# EAGLE design ring-modulator-v1.1 (EAGLE 6.5.0)
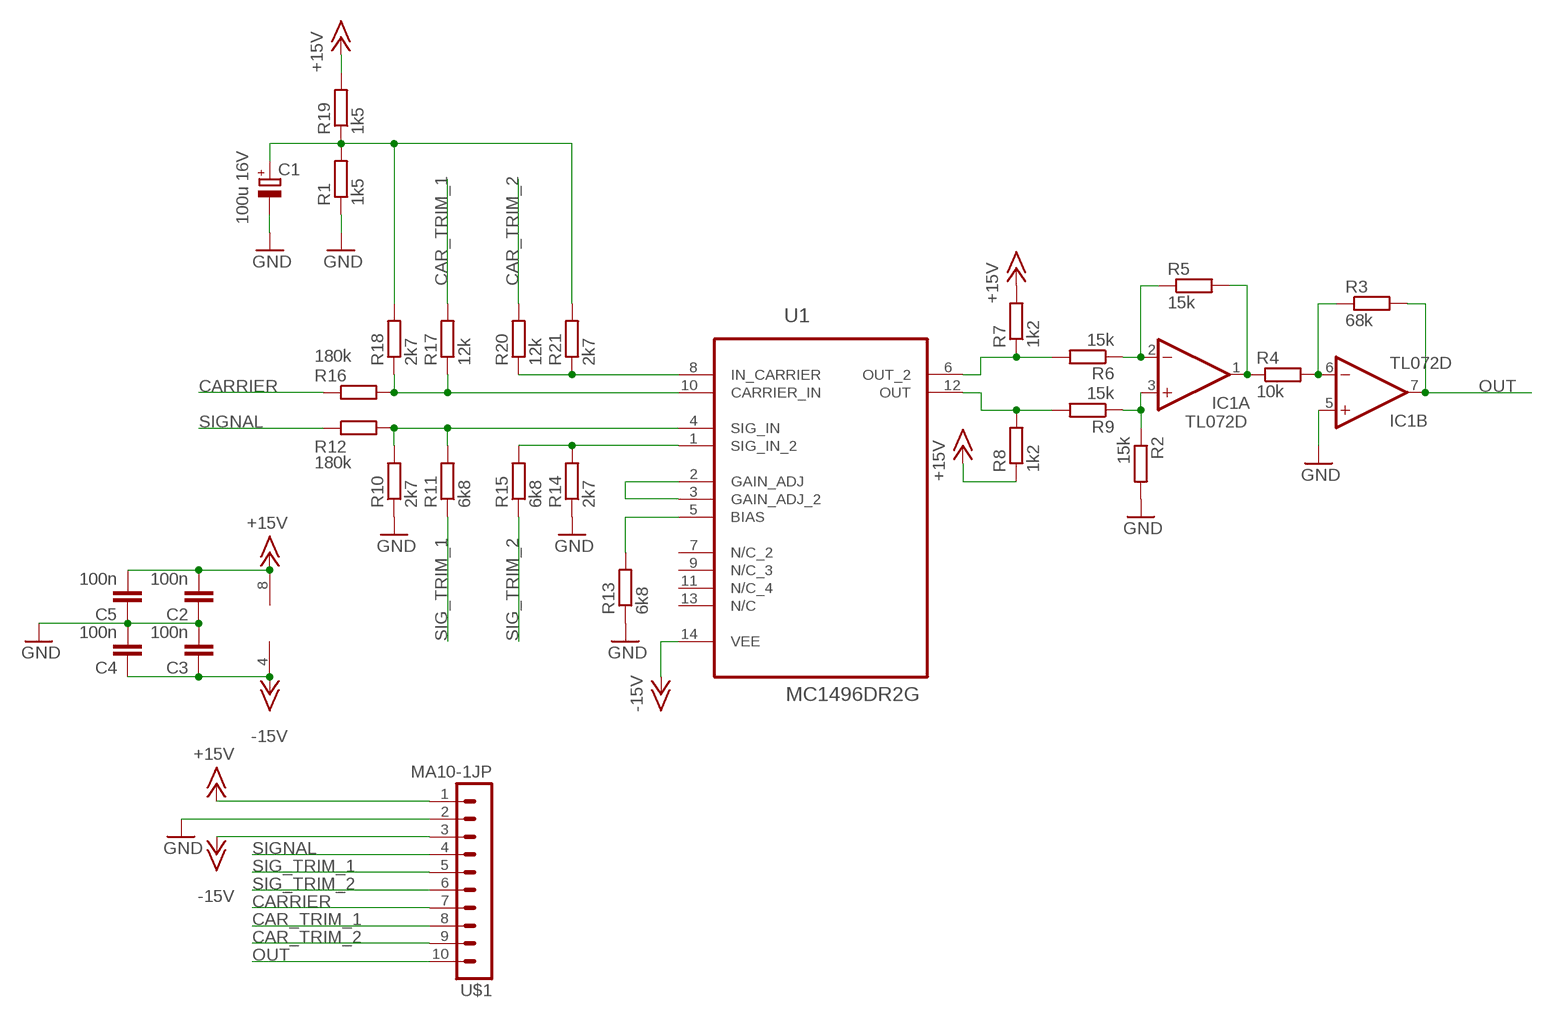
[diagram p0: schematic, sheet 1]

## Parts
C1  100u 16V  CPOL-EUE2.5-5  [E2,5-5]
C2  100n  C-EUC0805  [C0805]
C3  100n  C-EUC0805  [C0805]
C4  100n  C-EUC0805  [C0805]
C5  100n  C-EUC0805  [C0805]
IC1  TL072D  [SO08J]
R1  1k5  R-EU_R0805  [R0805]
R2  15k  R-EU_R0805  [R0805]
R3  68k  R-EU_R0805  [R0805]
R4  10k  R-EU_R0805  [R0805]
R5  15k  R-EU_R0805  [R0805]
R6  15k  R-EU_R0805  [R0805]
R7  1k2  R-EU_R0805  [R0805]
R8  1k2  R-EU_R0805  [R0805]
R9  15k  R-EU_R0805  [R0805]
R10  2k7  R-EU_R0805  [R0805]
R11  6k8  R-EU_R0805  [R0805]
R12  180k  R-EU_R0805  [R0805]
R13  6k8  R-EU_R0805  [R0805]
R14  2k7  R-EU_R0805  [R0805]
R15  6k8  R-EU_R0805  [R0805]
R16  180k  R-EU_R0805  [R0805]
R17  12k  R-EU_R0805  [R0805]
R18  2k7  R-EU_R0805  [R0805]
R19  1k5  R-EU_R0805  [R0805]
R20  12k  R-EU_R0805  [R0805]
R21  2k7  R-EU_R0805  [R0805]
U1  MC1496DR2G  [SOIC127P600X175-14N]
U$1  MA10-1JP  [SIP-PIN10-1J]

## Nets
+15V: C2.2 C5.2 IC1.8(P:V+) R7.2 R8.1 R19.2 U$1.1
-15V: C3.1 C4.1 IC1.4(P:V-) U1.14(VEE) U$1.3
CAR_TRIM_1: R17.2 U$1.8
CAR_TRIM_2: R20.2 U$1.9
CARRIER: R16.1 U$1.7
GND: C1.- C2.1 C3.2 C4.2 C5.1 IC1.5(B:+IN) R1.1 R2.2 R10.1 R13.1 R14.1 U$1.2
N$1: R10.2 R11.2 R12.2 U1.4(SIG_IN)
N$2: R16.2 R17.1 R18.1 U1.10(CARRIER_IN)
N$3: R14.2 R15.2 U1.1(SIG_IN_2)
N$8: R20.1 R21.1 U1.8(IN_CARRIER)
N$9: C1.+ R1.2 R18.2 R19.1 R21.2
N$11: R13.2 U1.5(BIAS)
N$12: U1.2(GAIN_ADJ) U1.3(GAIN_ADJ_2)
N$13: R6.2 R7.1 U1.6(OUT_2)
N$14: R8.2 R9.2 U1.12(OUT)
N$15: IC1.3(A:+IN) R2.1 R9.1
N$16: IC1.2(A:-IN) R5.1 R6.1
N$17: IC1.1(A:OUT) R4.1 R5.2
N$18: IC1.6(B:-IN) R3.1 R4.2
OUT: IC1.7(B:OUT) R3.2 U$1.10
SIG_TRIM_1: R11.1 U$1.5
SIG_TRIM_2: R15.1 U$1.6
SIGNAL: R12.1 U$1.4
Unconnected: U1.7(N/C_2) U1.9(N/C_3) U1.11(N/C_4) U1.13(N/C)

## Library data of the parts
C1 = resistor:CPOL-EU: POLARIZED CAPACITOR, European symbol
C2-C5 = resistor:C-EU: CAPACITOR, European symbol
IC1 = joakim:TL072: OP AMP
R1-R21 = resistor:R-EU_: RESISTOR, European symbol
U1 = ON Semiconductor_By_element14_Batch_1:MC1496DR2G: Balanced Modulators/Demodulators; MPN: MC1496DR2G; OC_FARNELL: 1651904; OC_NEWARK: 45J1148; PACKAGE: SOIC-14; SUPPLIER: ON SEMICONDUCTOR
U$1 = joakim:MA10-1J

## Board
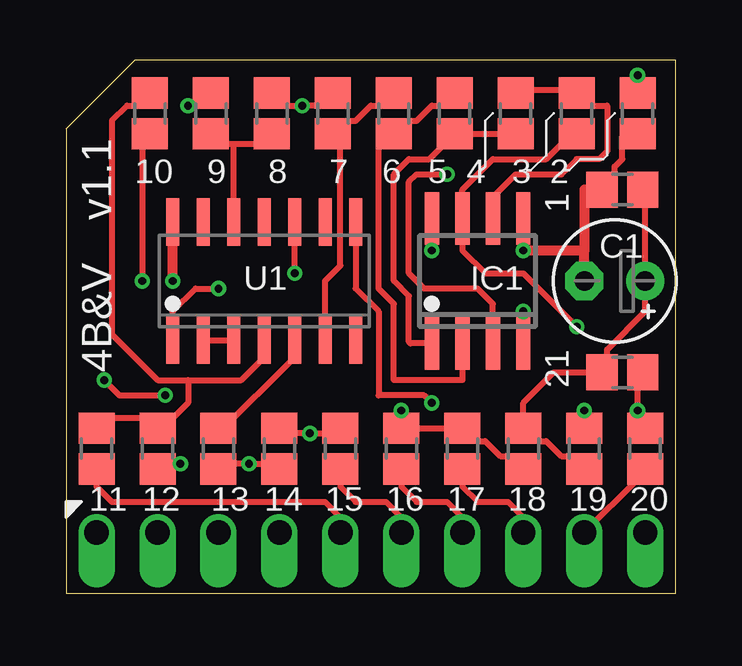
[diagram p1: board, top side]
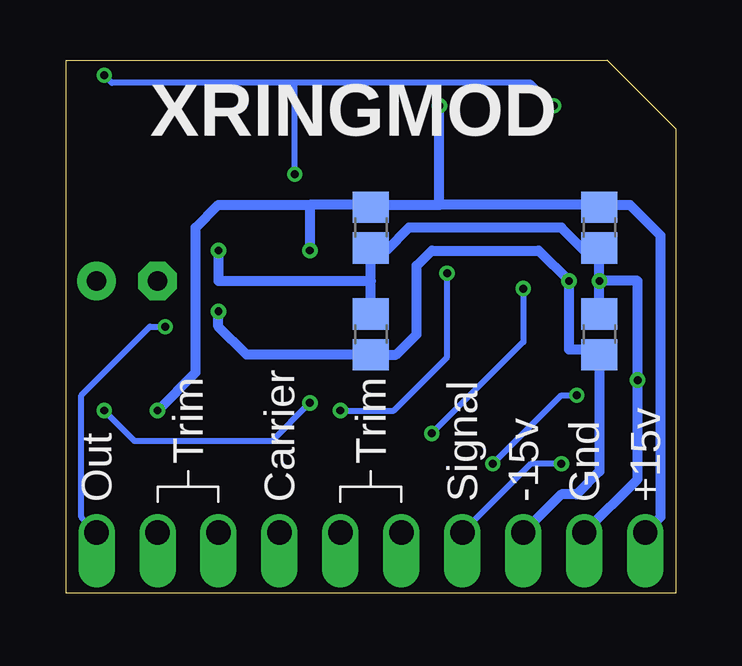
[diagram p2: board, bottom side, seen from below]

Size 25.4 x 22.23 mm. Coordinates in mm from the lower left corner, seen from the top.
Outline: 0,0 25.4,0 25.4,22.23 2.86,22.23 0,19.37 0,0
Copper layers (1*16): Top 0.035mm / dielectric 1.5mm / Bottom 0.035mm
Design rules "dirt_cheap_dirty_boards.v1": minimum track width 5mil, minimum drill 12mil, track to track 5mil, track to pad 5mil, pad to pad 5mil, via to via 5mil, smd to smd 0mil, copper to edge 10mil, drill to drill 10mil, minimum pad ring 10mil, minimum via ring 6mil, stop-mask expansion 2mil, vias tented up to drill 25mil, thermal gap 10mil

### Footprints (pad centres in the part's own frame; a part is rotated, then mirrored left to right if it is on the bottom)
E2,5-5 = drill 0.813 pad 1.6: + -1.27,0 | drill 0.813 pad 1.6 octagon: - 1.27,0
C0805 = smd 1.3 x 1.5: 1 -0.85,0; 2 0.85,0
SO08J = smd 0.6 x 2.2: 1 -1.905,-2.6; 2 -0.635,-2.6; 3 0.635,-2.6; 4 1.905,-2.6; 5 1.905,2.6; 6 0.635,2.6; 7 -0.635,2.6; 8 -1.905,2.6
R0805 = smd 1.3 x 1.5: 1 -0.85,0; 2 0.85,0
SOIC127P600X175-14N = smd 1.981 x 0.533: 1 -2.464,3.81; 2 -2.464,2.54; 3 -2.464,1.27; 4 -2.464,0; 5 -2.464,-1.27; 6 -2.464,-2.54; 7 -2.464,-3.81; 8 2.464,-3.81; 9 2.464,-2.54; 10 2.464,-1.27; 11 2.464,0; 12 2.464,1.27; 13 2.464,2.54; 14 2.464,3.81
SIP-PIN10-1J = drill 1.016 offset: 1 -11.43,0; 2 -8.89,0; 3 -6.35,0; 4 -3.81,0; 5 -1.27,0; 6 1.27,0; 7 3.81,0; 8 6.35,0; 9 8.89,0; 10 11.43,0

### Placement (x,y rotation side)
C1  22.86,13.02 180 top
C2  3.17,15.24 90 bottom
C3  3.17,10.79 90 bottom
C4  12.7,10.79 90 bottom
C5  12.7,15.24 90 bottom
IC1  17.14,13.02 0 top
R1  23.18,16.83 0 top
R2  23.81,20 270 top
R3  21.27,20 270 top
R4  18.73,20 90 top
R5  16.19,20 270 top
R6  13.65,20 90 top
R7  11.11,20 90 top
R8  8.57,20 270 top
R9  6.03,20 270 top
R10  3.49,20 90 top
R11  1.27,6.03 90 top
R12  3.81,6.03 90 top
R13  6.35,6.03 90 top
R14  8.89,6.03 90 top
R15  11.43,6.03 90 top
R16  13.97,6.03 90 top
R17  16.51,6.03 270 top
R18  19.05,6.03 90 top
R19  21.59,6.03 90 top
R20  24.13,6.03 270 top
R21  23.18,9.21 180 top
U1  8.26,13.02 90 top
U$1  12.7,2.54 0 top

### Tracks (layer width: path | path; a pad name or v marks a point on that pad's centre or on a via)
+15V  (via drill 0.33, 0.33 pad 0.25)
  Top 0.254: R8.1 8.57,20.32 v9.84,20.32 11.75,20.32 R7.2 | v21.59,7.62 R19.2
  Top 0.406: v15.24,14.29 IC1.8 15.24,14.92
  Bottom 0.406: U$1.1 0.64,3.17 0.64,14.92 1.91,16.19 3.17,16.19 | v21.59,7.62 20,9.21 20,15.24 19.05,16.19 15.24,16.19 | 12.7,16.19 9.84,16.19 | C2.2 3.17,16.19 | 3.17,16.19 9.84,16.19 | 9.84,16.19 v9.84,20.32 | C5.2 12.7,16.19 | 12.7,16.19 15.24,16.19 | 15.24,16.19 v15.24,14.29
-15V  (via drill 0.33)
  Top 0.406: v19.05,11.75 IC1.4 | v4.45,13.02 U1.14
  Bottom 0.406: v19.05,11.75 19.05,11.11 17.88,9.95 C4.1 11.64,9.95 10.79,10.79 10.79,13.65 10.16,14.29 5.71,14.29 v4.45,13.02 4.45,10.16 3.17,10.16 2.96,10.26 C3.1 3.17,5.08 4.13,4.13 4.76,4.13 U$1.3
CAR_TRIM_1
  Top 0.254: R17.2 16.51,4.45 17.14,3.81 18.41,3.81 19.05,3.17 U$1.8
CAR_TRIM_2
  Top 0.254: U$1.9 23.81,4.76 R20.2
CARRIER
  Top 0.254: R16.1 13.97,4.45 14.61,3.81 15.88,3.81 16.51,3.17 U$1.7
GND  (via drill 0.33)
  Top 0.254: IC1.5 v19.05,14.29 | v1.59,8.89 2.22,8.26 v4.13,8.26 | R14.1 8.68,5.4 v7.62,5.4 6.57,5.4 R13.1 | R10.1 3.49,18.73 3.17,18.73 v3.17,13.02 | R1.1 22.54,16.83 22.86,17.14 22.86,17.78 23.18,18.1 23.18,19.05 23.71,19.05 R2.2
  Top 0.406: C1.- 21.59,14.29 | 21.59,14.29 v19.05,14.29 | R1.1 21.59,16.83 21.59,14.29
  Bottom 0.254: v7.62,5.4 4.76,8.26 v4.13,8.26 | 12.8,14.29 C5.1
  Bottom 0.406: C4.2 12.7,13.02 | 12.7,13.02 C5.1 | C3.2 v3.17,13.02 | v3.17,13.02 C2.1 3.17,14.29 3.81,14.29 4.76,15.24 11.11,15.24 12.06,14.29 12.7,14.29 C5.1 | U$1.2 1.59,4.76 v1.59,8.89 1.59,13.02 v3.17,13.02 | v19.05,14.29 19.05,13.02 12.7,13.02 | 12.91,14.07 12.91,14.29 C5.1
N$1
  Top 0.254: 5.08,8.89 3.81,8.89 1.91,10.79 1.91,19.68 2.54,20.32 3.49,20.32 R10.2 | 5.08,8.89 7.3,8.89 8.26,9.84 U1.4 | 5.08,8.89 5.08,7.94 4.45,7.3 4.23,7.3 | 4.13,7.3 3.81,6.99 R12.2 4.23,7.3 | 4.23,7.3 1.69,7.3 R11.2
N$2  (via drill 0.33)
  Top 0.254: v13.97,7.62 R16.2 R17.1 16.61,6.88 17.14,6.35 17.46,6.35 18.1,5.71 18.52,5.71 R18.1 | v9.53,13.34 U1.10
  Bottom 0.254: v13.97,7.62 11.75,7.62 9.53,9.84 v9.53,13.34
N$3  (via drill 0.33)
  Top 0.254: U1.1 4.45,11.75 5.4,12.7 v6.35,12.7 | R15.2 11.21,6.67 v10.16,6.67 9.11,6.67 R14.2
  Bottom 0.254: v6.35,12.7 6.35,10.48 v10.16,6.67
N$8  (via drill 0.33)
  Top 0.254: U1.8 12.06,12.7 13.02,11.75 13.02,8.26 14.92,8.26 v15.24,7.94 | R20.1 v23.81,7.62 23.81,9.21 24.13,9.11 R21.1
  Bottom 0.254: v15.24,7.94 16.83,6.35 22.54,6.35 v23.81,7.62
N$9
  Top 0.254: R19.1 21.06,5.71 20.64,5.71 20,6.35 19.68,6.35 19.15,6.88 R18.2 19.05,7.94 20.32,9.21 R21.2 22.33,9.63 22.54,9.84 22.54,10.16 24.13,11.75 C1.+ 24.13,16.73 R1.2
N$11
  Top 0.254: R13.2 6.35,6.67 9.53,9.84 U1.5
N$12
  Top 0.254: U1.2 U1.3
N$13
  Top 0.254: U1.6 10.79,13.02 11.43,13.65 11.43,19.15 | R7.1 11.43,19.15 | 11.43,19.15 11.43,19.37 11.75,19.68 12.06,19.68 12.7,20.32 13.12,20.32 R6.2
N$14
  Top 0.254: R9.2 6.03,18.73 6.99,18.73 | 6.99,18.73 8.57,18.73 R8.2 | U1.12 6.99,18.73
N$15  (via drill 0.33)
  Top 0.254: v23.81,21.59 R2.1 | R9.1 6.03,20.32 v5.08,20.32 | 17.78,9.84 IC1.3 17.78,12.06 17.14,12.7 14.92,12.7 14.29,13.34 14.29,17.14 14.61,17.46 v15.88,17.46
  Bottom 0.254: v5.08,20.32 6.03,21.27 15.88,21.27 | 15.88,21.27 23.5,21.27 v23.81,21.59 | v15.88,17.46 15.88,21.27
N$16
  Top 0.254: IC1.2 16.51,8.89 13.65,8.89 13.65,12.06 13.02,12.7 13.02,18.73 13.65,19.37 R6.1 13.65,19.68 14.61,19.68 15.24,20.32 16.19,20.32 R5.1
N$17
  Top 0.254: R4.1 R5.2 15.14,18.1 14.29,18.1 13.65,17.46 13.65,13.02 14.29,12.38 14.29,10.48 14.35,10.42 IC1.1
N$18
  Top 0.254: IC1.6 17.78,16.51 18.73,17.46 20.64,17.46 21.27,18.1 22.23,18.1 22.54,18.41 22.54,20.32 21.27,20.32 R3.1 21.27,20.64 20.95,20.95 19.27,20.95 R4.2
OUT  (via drill 0.33)
  Top 0.254: v21.27,11.11 19.05,13.34 17.46,13.34 16.51,14.29 IC1.7 16.51,16.83 17.78,18.1 20,18.1 21.27,19.37 R3.2
  Bottom 0.254: U$1.10 24.77,3.17 24.77,8.26 21.91,11.11 v21.27,11.11
SIG_TRIM_1
  Top 0.254: U$1.5 11.43,3.17 10.79,3.81 1.91,3.81 1.27,4.45 R11.1
SIG_TRIM_2
  Top 0.254: R15.1 11.43,4.45 12.06,3.81 13.34,3.81 13.97,3.17 U$1.6
SIGNAL  (via drill 0.33)
  Top 0.254: R12.1 4.03,5.18 4.13,5.08 v4.76,5.4
  Bottom 0.254: v4.76,5.4 6.03,5.4 U$1.4

### Text on the board
tNames: 10 | 9 | 8 | 7 | 6 | 5 | 4 | 3 | 2 | v1.1 | 1 | U1 | IC1 | C1 | 4B&V | 21 | 11 | 12 | 13 | 14 | 15 | 16 | 17 | 18 | 19 | 20
bNames: XRINGMOD | Trim | Trim | +15v | Gnd | -15v | Signal | Carrier | Out